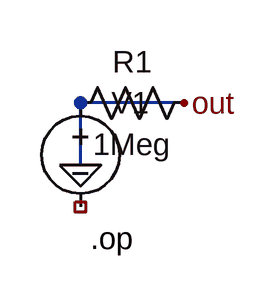
[diagram p0: schematic utf16_divider.asc]
utf16_divider.asc, the LTspice schematic file:
Version 4
SHEET 1 880 680
WIRE 128 96 48 96
WIRE 48 144 48 96
FLAG 48 144 0
FLAG 128 96 out
SYMBOL voltage 48 80 R0
WINDOW 3 24 96 Invisible 2
SYMATTR InstName V1
SYMATTR Value 3.3
SYMBOL res 144 80 R90
WINDOW 0 0 56 VBottom 2
WINDOW 3 32 56 VTop 2
SYMATTR InstName R1
SYMATTR Value 1Meg
TEXT 56 200 Left 2 !.op

The netlist it stands for:
* utf16_divider.asc
V1 0 NC_01 3.3
R1 0 0 1Meg
.op
.backanno
.end